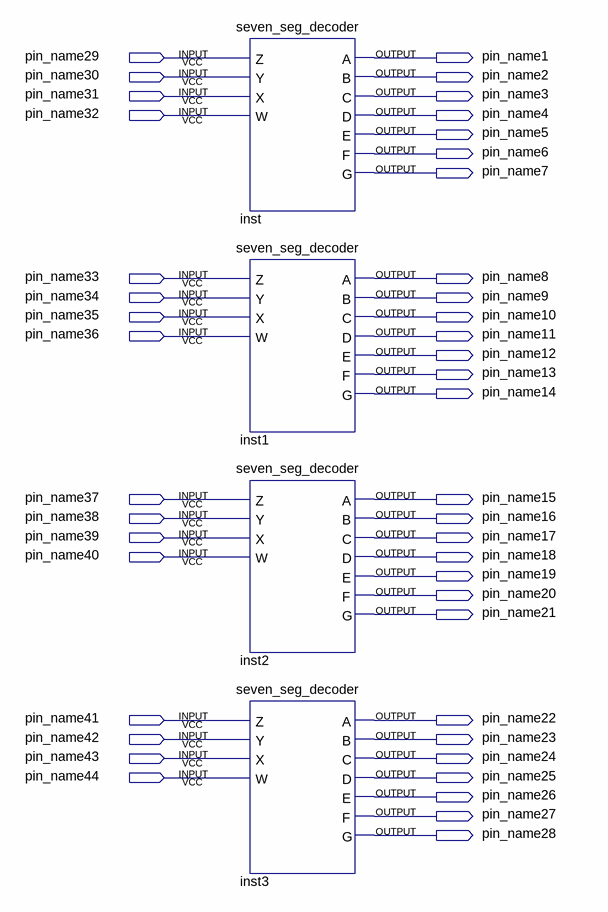
[diagram p0: schematic sheet]
// Quartus schematic adder.bdf as structural Verilog: 4 symbols, 44 pins
module adder (
  input  pin_name29,
  input  pin_name30,
  input  pin_name31,
  input  pin_name32,
  input  pin_name33,
  input  pin_name34,
  input  pin_name35,
  input  pin_name36,
  input  pin_name37,
  input  pin_name38,
  input  pin_name39,
  input  pin_name40,
  input  pin_name41,
  input  pin_name42,
  input  pin_name43,
  input  pin_name44,
  output pin_name1,
  output pin_name2,
  output pin_name3,
  output pin_name4,
  output pin_name5,
  output pin_name6,
  output pin_name7,
  output pin_name8,
  output pin_name9,
  output pin_name10,
  output pin_name11,
  output pin_name12,
  output pin_name13,
  output pin_name14,
  output pin_name15,
  output pin_name16,
  output pin_name17,
  output pin_name18,
  output pin_name19,
  output pin_name20,
  output pin_name21,
  output pin_name22,
  output pin_name23,
  output pin_name24,
  output pin_name25,
  output pin_name26,
  output pin_name27,
  output pin_name28
);

  seven_seg_decoder inst (
    .Z(pin_name29), .Y(pin_name30), .X(pin_name31), .W(pin_name32), .A(pin_name1), .B(pin_name2),
    .C(pin_name3), .D(pin_name4), .E(pin_name5), .F(pin_name6), .G(pin_name7));
  seven_seg_decoder inst1 (
    .Z(pin_name33), .Y(pin_name34), .X(pin_name35), .W(pin_name36), .A(pin_name8), .B(pin_name9),
    .C(pin_name10), .D(pin_name11), .E(pin_name12), .F(pin_name13), .G(pin_name14));
  seven_seg_decoder inst2 (
    .Z(pin_name37), .Y(pin_name38), .X(pin_name39), .W(pin_name40), .A(pin_name15), .B(pin_name16),
    .C(pin_name17), .D(pin_name18), .E(pin_name19), .F(pin_name20), .G(pin_name21));
  seven_seg_decoder inst3 (
    .Z(pin_name41), .Y(pin_name42), .X(pin_name43), .W(pin_name44), .A(pin_name22), .B(pin_name23),
    .C(pin_name24), .D(pin_name25), .E(pin_name26), .F(pin_name27), .G(pin_name28));
endmodule
